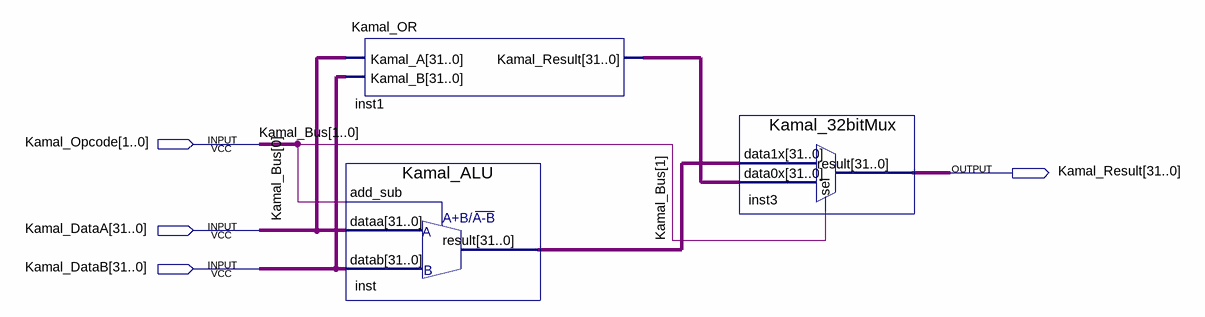
[diagram p0: schematic sheet]
// Quartus schematic Kamal_CompleteALU.bdf as structural Verilog: 3 symbols, 4 pins
module Kamal_CompleteALU (
  input  [1:0] Kamal_Opcode,
  input  [31:0] Kamal_DataA,
  input  [31:0] Kamal_DataB,
  output [31:0] Kamal_Result
);

  wire [31:0] inst1_kamal_result, inst_result;

  Kamal_OR inst1 (.Kamal_A(Kamal_DataA), .Kamal_B(Kamal_DataB), .Kamal_Result(inst1_kamal_result));
  Kamal_ALU inst (.add_sub(Kamal_Opcode[0]), .dataa(Kamal_DataA), .datab(Kamal_DataB), .result(inst_result));
  Kamal_32bitMux inst3 (
    .data1x(inst_result), .data0x(inst1_kamal_result), .sel(Kamal_Opcode[1]), .result(Kamal_Result));

  // Other names for the same wires on the sheet: Kamal_Bus[1:0] = Kamal_Opcode
endmodule
